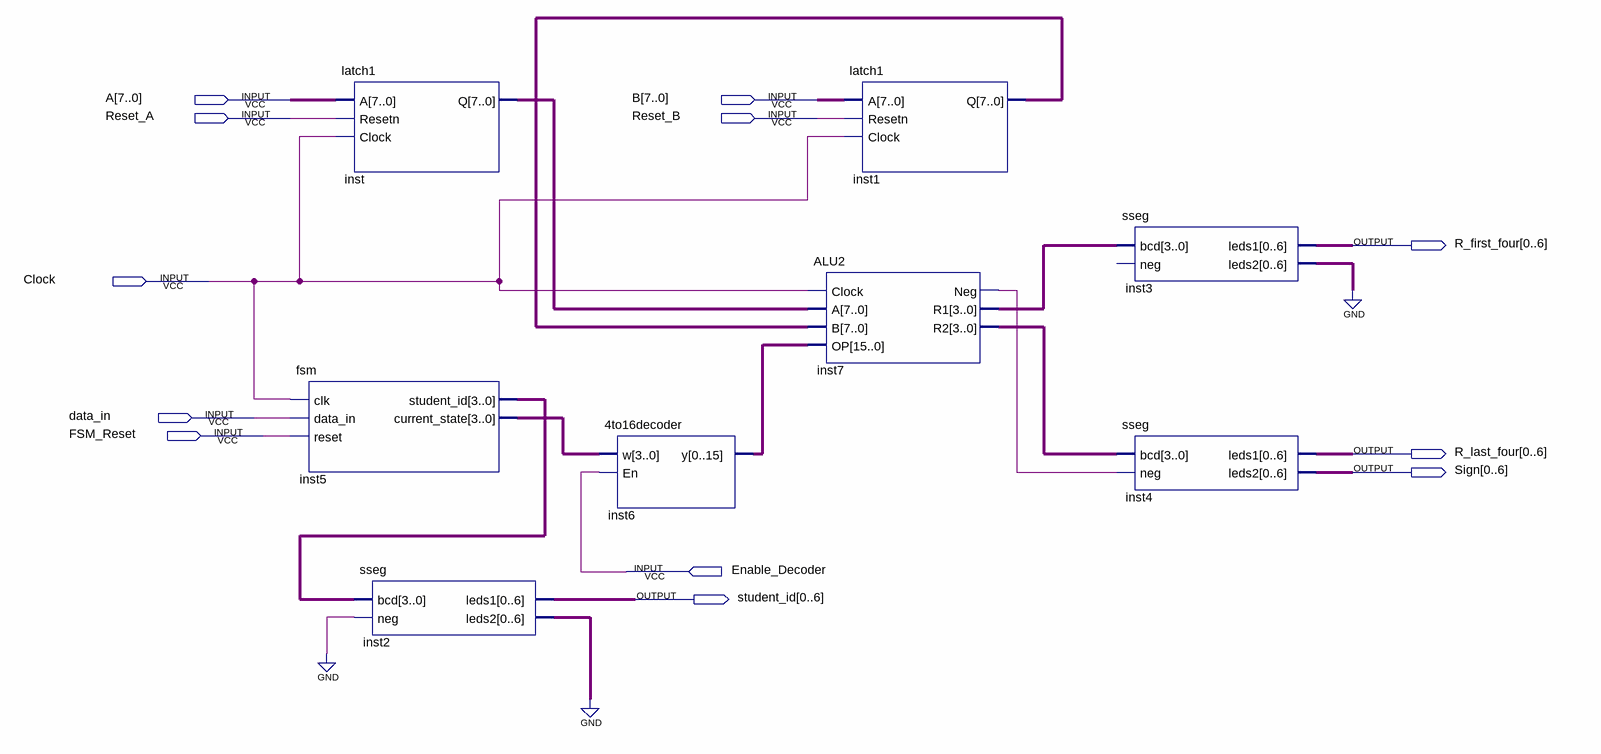
[diagram p0: schematic sheet]
// Quartus schematic problem2.bdf as structural Verilog: 8 symbols, 12 pins
module problem2 (
  input  [7:0] A,
  input  [7:0] B,
  input  Reset_A,
  input  Reset_B,
  input  Clock,
  input  data_in,
  input  FSM_Reset,
  input  Enable_Decoder,
  output [0:6] R_first_four,
  output [0:6] R_last_four,
  output [0:6] Sign,
  output [0:6] student_id
);

  wire inst7_neg;
  wire [3:0] inst5_current_state, inst5_student_id, inst7_r1, inst7_r2;
  wire [6:0] inst2_leds2, inst3_leds2;
  wire [7:0] inst1_q, inst_q;
  wire [15:0] inst6_y;

  fsm inst5 (
    .clk(Clock), .data_in(data_in), .reset(FSM_Reset), .student_id(inst5_student_id),
    .current_state(inst5_current_state));
  latch1 inst (.A(A), .Resetn(Reset_A), .Clock(Clock), .Q(inst_q));
  sseg inst2 (.bcd(inst5_student_id), .neg(1'b0), .leds1(student_id), .leds2(inst2_leds2));
  \4to16decoder  inst6 (.w(inst5_current_state), .En(Enable_Decoder), .y(inst6_y));
  ALU2 inst7 (.Clock(Clock), .A(inst_q), .B(inst1_q), .OP(inst6_y), .Neg(inst7_neg), .R1(inst7_r1), .R2(inst7_r2));
  latch1 inst1 (.A(B), .Resetn(Reset_B), .Clock(Clock), .Q(inst1_q));
  sseg inst3 (.bcd(inst7_r1), .leds1(R_first_four), .leds2(inst3_leds2));  // open: neg
  sseg inst4 (.bcd(inst7_r2), .neg(inst7_neg), .leds1(R_last_four), .leds2(Sign));
  // also tied to GND on the sheet: {inst2_leds2[0], inst2_leds2[1], inst2_leds2[2], inst2_leds2[3], inst2_leds2[4], inst2_leds2[5], inst2_leds2[6], inst3_leds2[0], inst3_leds2[1], inst3_leds2[2], inst3_leds2[3], inst3_leds2[4], inst3_leds2[5], inst3_leds2[6]}
endmodule
